# EAGLE design fabenergy.node.v1 (EAGLE 5.11)
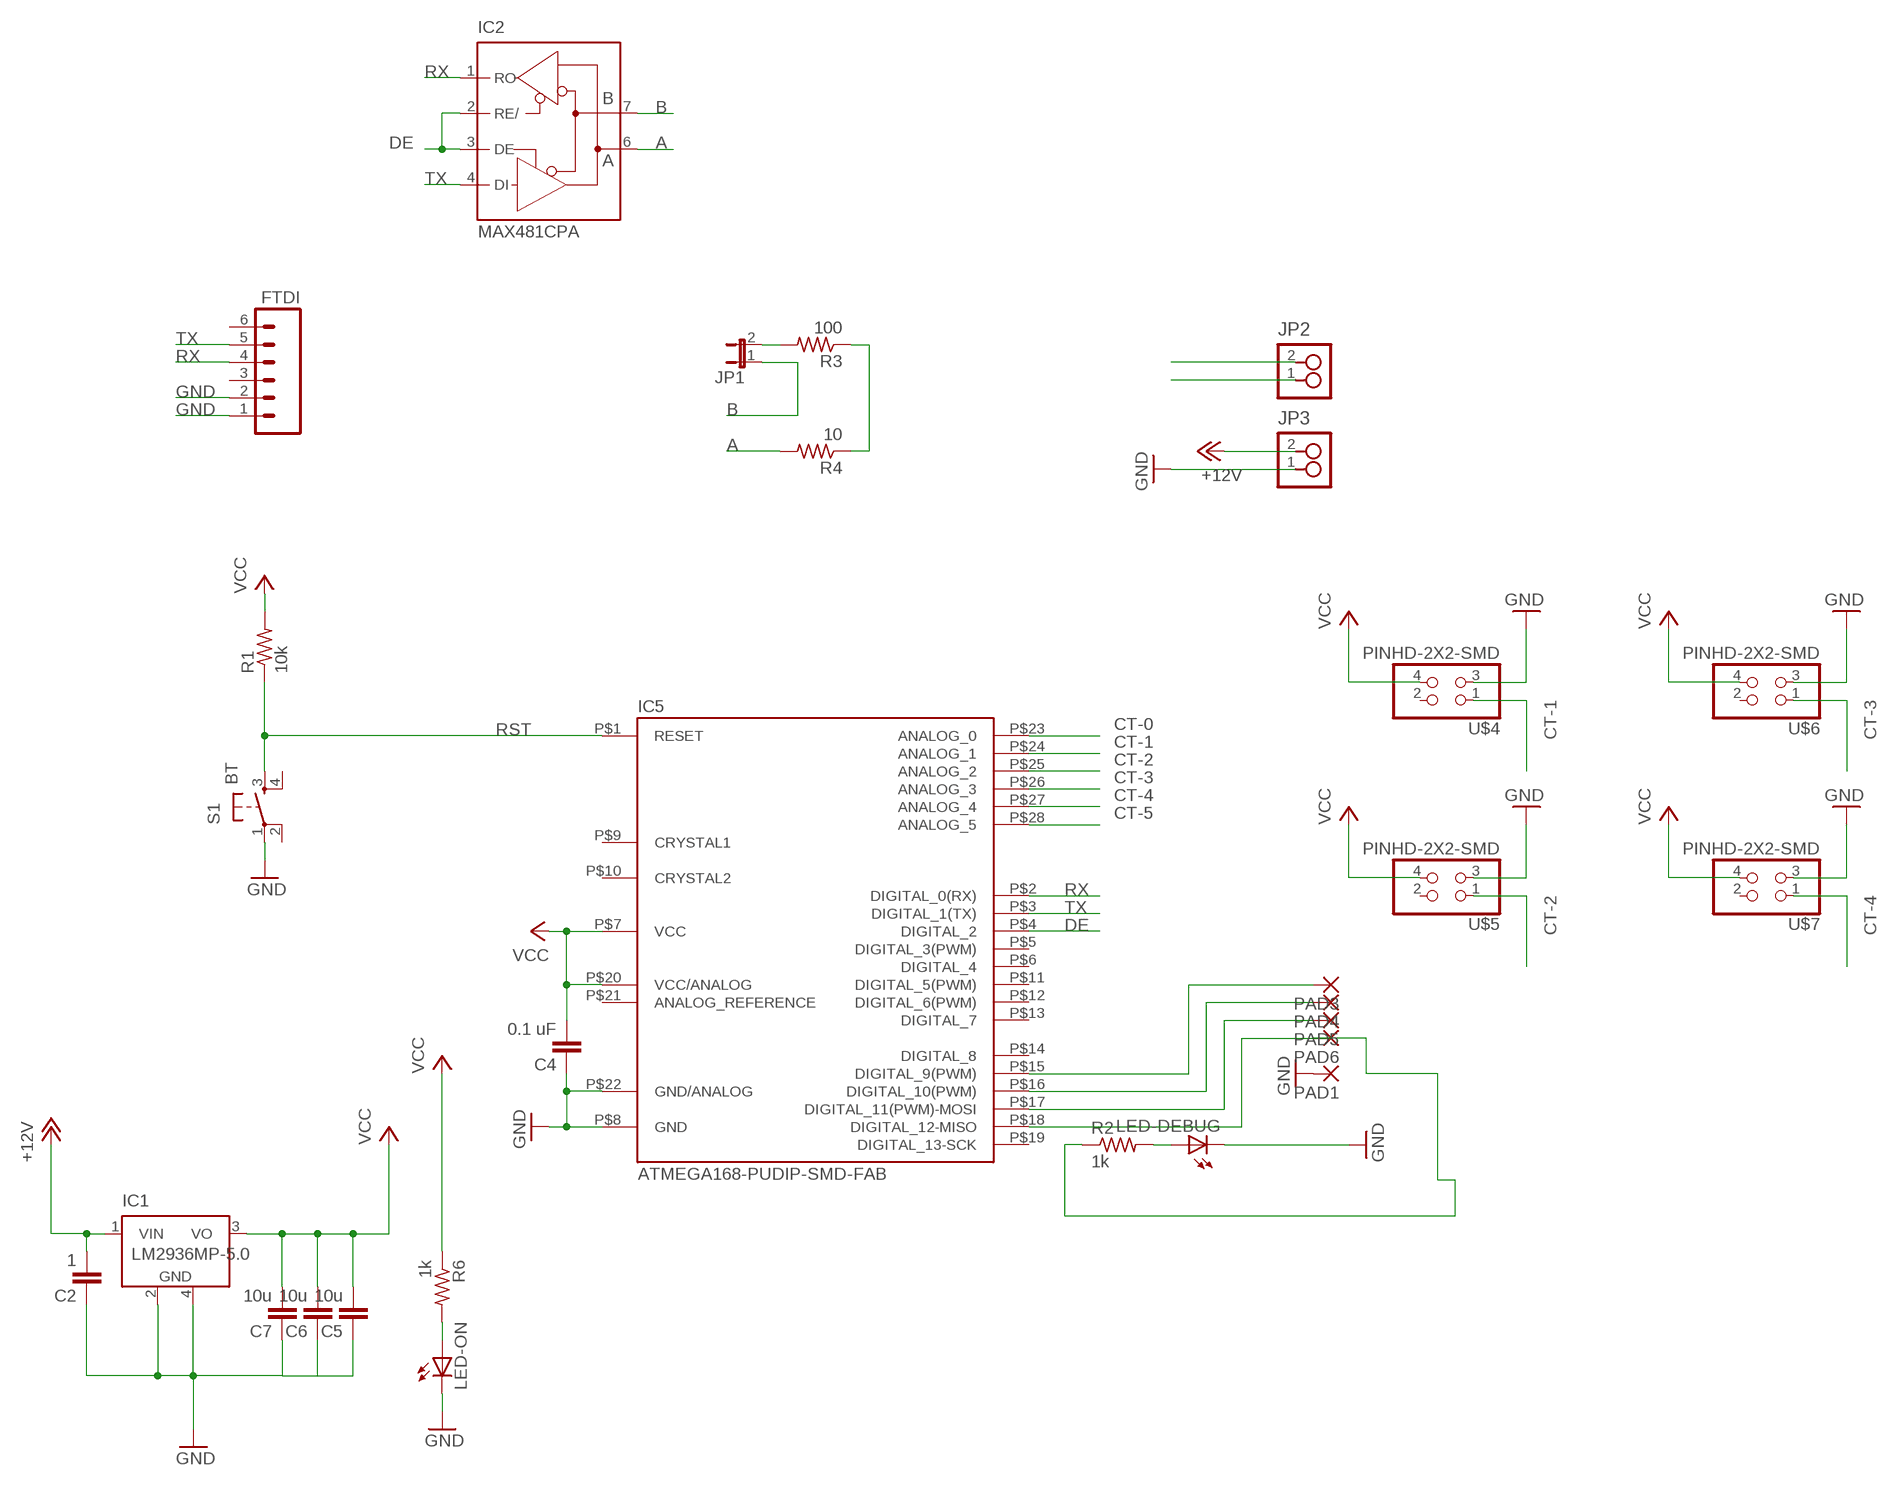
[diagram p0: schematic, sheet 1]

## Parts
C2  1  C-EUC1206  [C1206]
C4  0.1 uF  C-EUC1206  [C1206]
C5  10u  C-EUC1206  [C1206]
C6  10u  C-EUC1206  [C1206]
C7  10u  C-EUC1206  [C1206]
FTDI  M06SMD  [1X06-SMD]
IC1  LM2936MP-5.0  [SOT223]
IC2  MAX481CPA  [DIL08]
IC5  ATMEGA168-PUDIP-SMD-FAB  [DIL28-3-FAB-SMD]
JP1  JUMPER-2PTH  [1X02]
JP2  2_PIN_HEADERSCREW  [SCREW_2]
JP3  2_PIN_HEADERSCREW  [SCREW_2]
LED-DEBUG  LED1206  [1206]
LED-ON  LED1206  [1206]
PAD1  SMD2  [SMD1,27-2,54]
PAD3  SMD2  [SMD1,27-2,54]
PAD4  SMD2  [SMD1,27-2,54]
PAD5  SMD2  [SMD1,27-2,54]
PAD6  SMD2  [SMD1,27-2,54]
R1  10k  RESISTOR1206  [1206]
R2  1k  RESISTOR1206  [1206]
R3  100  RESISTOR1206  [1206]
R4  10  RESISTOR1206  [1206]
R6  1k  RESISTOR1206  [1206]
S1  BT  6MM_SWITCH6MM_SWITCH  [6MM_SWITCH]
U$4  PINHD-2X2-SMD  [2X02SMD]
U$5  PINHD-2X2-SMD  [2X02SMD]
U$6  PINHD-2X2-SMD  [2X02SMD]
U$7  PINHD-2X2-SMD  [2X02SMD]

## Nets
+12V: C2.2 IC1.1(VIN) JP3.2
A: IC2.6(A) JP2.2 R4.2
B: IC2.7(B) JP1.1 JP2.1
CT-0: IC5.P$23(ANALOG_0)
CT-1: IC5.P$24(ANALOG_1) U$4.1
CT-2: IC5.P$25(ANALOG_2) U$5.1
CT-3: IC5.P$26(ANALOG_3) U$6.1
CT-4: IC5.P$27(ANALOG_4) U$7.1
CT-5: IC5.P$28(ANALOG_5)
DE: IC2.2(RE/) IC2.3(DE) IC5.P$4(DIGITAL_2)
GND: C2.1 C4.1 C5.1 C6.1 C7.1 FTDI.1 FTDI.2 IC1.2(GND) IC1.4(GND) IC5.P$8(GND) IC5.P$22(GND/ANALOG) JP3.1 LED-DEBUG.2(C) LED-ON.2(C) PAD1.1(P) S1.1(P) U$4.3 U$5.3 U$6.3 U$7.3
N$1: LED-ON.1(A) R6.2
N$2: LED-DEBUG.1(A) R2.2
N$3: R3.1 R4.1
N$4: IC5.P$15(DIGITAL_9(PWM)) PAD3.1(P)
N$6: IC5.P$17(DIGITAL_11(PWM)-MOSI) PAD5.1(P)
N$7: IC5.P$16(DIGITAL_10(PWM)) PAD4.1(P)
N$8: JP1.2 R3.2
N$11: IC5.P$18(DIGITAL_12-MISO) PAD6.1(P) R2.1
RST: IC5.P$1(RESET) R1.1 S1.3(S)
RX: FTDI.4 IC2.1(RO) IC5.P$2(DIGITAL_0(RX))
TX: FTDI.5 IC2.4(DI) IC5.P$3(DIGITAL_1(TX))
VCC: C4.2 C5.2 C6.2 C7.2 IC1.3(VO) IC5.P$7(VCC) IC5.P$20(VCC/ANALOG) R1.2 R6.1 U$4.4 U$5.4 U$6.4 U$7.4
Unconnected: FTDI.3 FTDI.6 IC5.P$5(DIGITAL_3(PWM)) IC5.P$6(DIGITAL_4) IC5.P$9(CRYSTAL1) IC5.P$10(CRYSTAL2) IC5.P$11(DIGITAL_5(PWM)) IC5.P$12(DIGITAL_6(PWM)) IC5.P$13(DIGITAL_7) IC5.P$14(DIGITAL_8) IC5.P$19(DIGITAL_13-SCK) IC5.P$21(ANALOG_REFERENCE) S1.2(P1) S1.4(S1) U$4.2 U$5.2 U$6.2 U$7.2

## Power pins joined to a net without a drawn wire
GND: IC2.5(GND)
VCC: IC2.8(VCC)

## Library data of the parts
C2 C4-C7 = rcl:C-EU: CAPACITOR, European symbol
FTDI = SparkFun:M06: Header 6 Standard 6-pin 0.1" header. Use with straight break away headers (SKU : PRT-00116), right angle break away headers (PRT-00553), swiss pins (PRT-00743), machine pins (PRT-00117), and female headers (PRT-00115). Molex polarized connector foot print use with SKU : PRT-08094 with associated crimp pins and housings. NOTES ON THE VARIANTS LOCK and LOCK_LONGPADS... This footprint was designed to help hold the alignment of a through-hole component (i.e. 6-pin header) while soldering it into place. You may notice that each hole has been shifted either up or down by 0.005 of an inch from it's more standard position (which is a perfectly straight line). This slight alteration caused the pins (the squares in the middle) to touch the edges of the holes. Because they are alternating, it causes a "brace" to hold the component in place. 0.005 has proven to be the perfect amount of "off-center" position when using our standard breakaway headers. Although looks a little odd when you look at the bare footprint, once you have a header in there, the alteration is very hard to notice. Also, if you push a header all the way into place, it is covered up entirely on the bottom side. This idea of altering the position of holes to aid alignment will be further integrated into the Sparkfun Library for other footprints. It can help hold any component with 3 or more connection pins.
IC1 = national-semiconductor:LM2936MP?*: Ultra-Low Quiescent Current LDO Voltage Regulator Source: Data sheet <http://www.national.com/ds/LM/LM2936.pdf>; MF: NATIONAL SEMICONDUCTOR; MPN: LM2936MP-5.0/NOPB; OC_FARNELL: 1469063; OC_NEWARK: 41K4524
IC2 = maxim:MAX481CPA: RS485 TRANSEIVER
IC5 = Arduino-AVR:ATMEGA168-PU
JP1 = SparkFun:JUMPER-2: Jumper Basic 0.1" spaced jumper. Use with breakaway headers.
JP2 JP3 = ng:2_PIN_HEADER: 2 SMT pin pads
LED-DEBUG LED-ON = ng:LED
PAD1 PAD3-PAD6 = wirepad:SMD2: SMD PAD
R1-R4 R6 = ng:RESISTOR
S1 = ng:6MM_SWITCH: OMRON SWITCH
U$4-U$7 = fab:PINHD-2X2-SMD

## Net classes
0 default: width 0.203 mm
1 power: width 0.254 mm

## Board
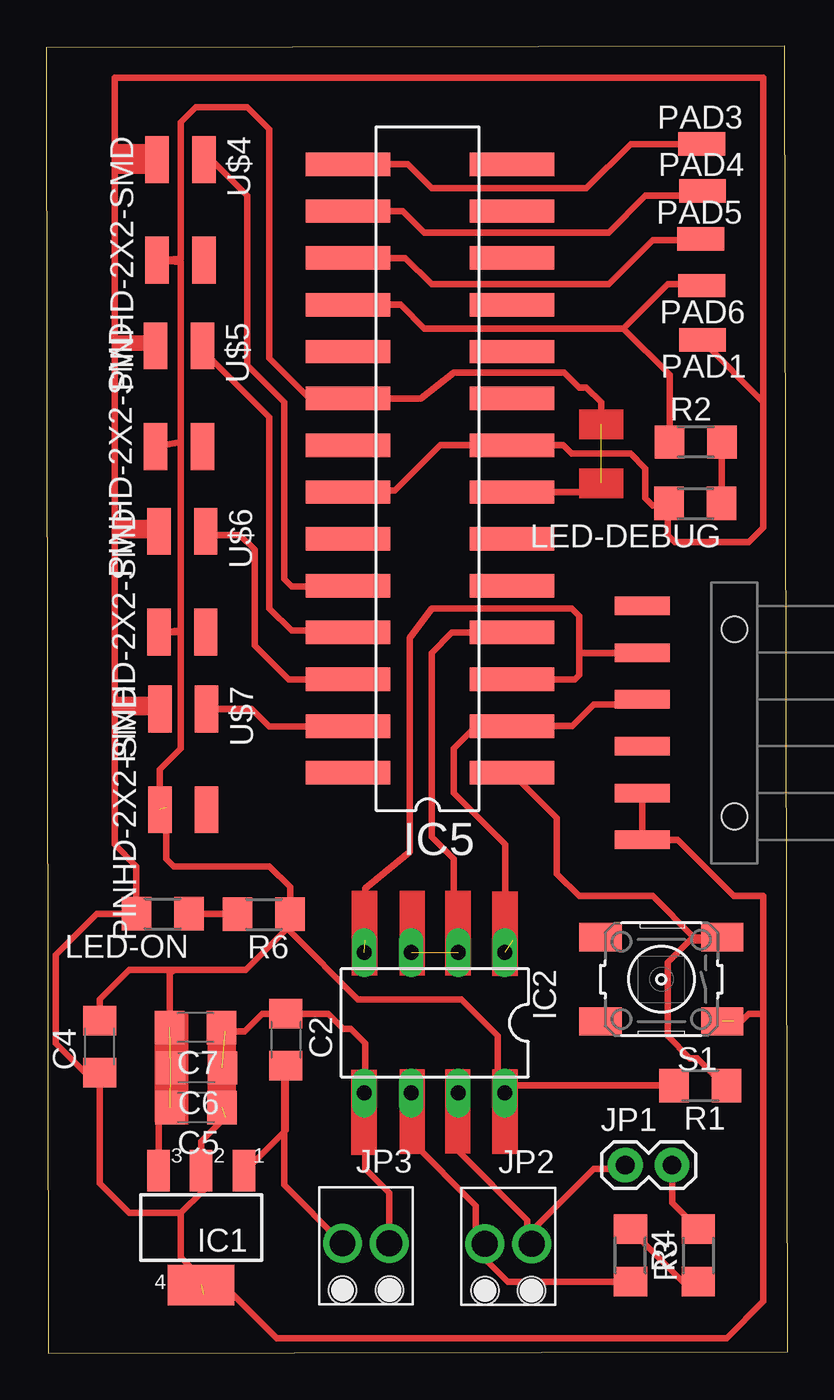
[diagram p1: board, top side]

Size 40.23 x 70.94 mm. Coordinates in mm from the lower left corner, seen from the top.
Outline: 0.13,0 40.23,0.1 40.08,70.94 0,70.84 0.13,0
Copper layers (1*16): Top 0.035mm / dielectric 1.5mm / Bottom 0.035mm
Design rules "fab-tets *": minimum track width 0.35mm, minimum drill 24mil, track to track 14mil, track to pad 14mil, pad to pad 14mil, via to via 14mil, smd to smd 14mil, copper to edge 8mil, drill to drill 8mil, minimum pad ring 10mil, minimum via ring 8mil, stop-mask expansion 4mil, vias tented up to drill 0mil, thermal gap 10mil

### Footprints (pad centres in the part's own frame; a part is rotated, then mirrored left to right if it is on the bottom)
C1206 = smd 1.6 x 1.8: 1 -1.4,0; 2 1.4,0
1X06-SMD = smd 1 x 3: 1 -6.35,5; 2 -3.81,5; 3 -1.27,5; 4 1.27,5; 5 3.81,5; 6 6.35,5 | hole 1.4: -5.08,0; 5.08,0
SOT223 = smd 1.219 x 2.235: 1 -2.311,-3.099; 2 0,-3.099; 3 2.311,-3.099 | smd 3.6 x 2.2: 4 0,3.099
DIL08 = drill 0.813 long: 1 -3.81,-3.81; 2 -1.27,-3.81; 3 1.27,-3.81; 4 3.81,-3.81; 5 3.81,3.81; 6 1.27,3.81; 7 -1.27,3.81; 8 -3.81,3.81
DIL28-3-FAB-SMD = smd 1.27 x 4.572: P$1 -16.51,-4.572; P$2 -13.97,-4.572; P$3 -11.43,-4.572; P$4 -8.89,-4.572; P$5 -6.35,-4.572; P$6 -3.81,-4.572; P$7 -1.27,-4.572; P$8 1.27,-4.572; P$9 3.81,-4.572; P$10 6.35,-4.572; P$11 8.89,-4.572; P$12 11.43,-4.572; P$13 13.97,-4.572; P$14 16.51,-4.572; P$15 16.51,4.318; P$16 13.97,4.318; P$17 11.43,4.318; P$18 8.89,4.318; P$19 6.35,4.318; P$20 3.81,4.318; P$21 1.27,4.318; P$22 -1.27,4.318; P$23 -3.81,4.318; P$24 -6.35,4.318; P$25 -8.89,4.318; P$26 -11.43,4.318; P$27 -13.97,4.318; P$28 -16.51,4.318
1X02 = drill 1.016 pad 1.88 round: 1 0,0; 2 2.54,0
SCREW_2 = drill 1.4 pad 2.108 round: 1 -1.27,-1.27; 2 1.27,-1.27 | hole 1.5: 1.27,1.27; -1.27,1.27
1206 = smd 1.6 x 1.803: 1 -1.422,0; 2 1.422,0
SMD1,27-2,54 = smd 1.27 x 2.54: 1 0,0
6MM_SWITCH = smd 2.286 x 1.524: 1 -3.302,2.286; 2 3.302,2.286; 3 -3.302,-2.286; 4 3.302,-2.286
2X02SMD = smd 2.54 x 1.27: 1 -2.54,1.27; 2 2.92,1.27; 3 -2.54,-1.27; 4 2.92,-1.27

### Placement (x,y rotation side)
C2  13,17.03 270 top
C4  2.91,16.65 90 top
C5  8.13,13.34 180 top
C6  8.16,15.5 180 top
C7  8.11,17.68 180 top
FTDI  37.34,34.22 90 top
IC1  8.41,6.82 180 top
IC2  21.08,17.94 180 top
IC5  20.7,48.01 90 top
JP1  31.42,10.22 0 top
JP2  25.07,4.68 180 top
JP3  17.35,4.71 180 top
LED-DEBUG  35.22,46.13 180 top
LED-ON  6.32,23.86 180 top
PAD1  35.61,55 90 top
PAD3  35.56,65.64 270 top
PAD4  35.61,63.08 270 top
PAD5  35.51,60.48 270 top
PAD6  35.56,57.95 90 top
R1  35.48,14.54 180 top
R2  35.25,49.46 0 top
R3  35.38,5.32 90 top
R4  31.7,5.32 270 top
R6  11.81,23.83 180 top
S1  33.38,20.3 180 top
U$4  7.29,62.24 270 top
U$5  7.21,52.13 270 top
U$6  7.39,42.07 270 top
U$7  7.44,32.43 270 top

### Tracks (layer width: path | path; a pad name or v marks a point on that pad's centre or on a via)
+12V
  Top 0.35: IC1.1 10.81,9.92 12.91,12.02 | 12.91,12.02 12.91,15.54 C2.2 13,12.11 12.91,12.02 | 12.91,12.02 12.91,9.14 JP3.2
A
  Top 0.35: IC2.6 19.81,11.52 23.31,8.02 23.31,6.44 JP2.2 23.71,5.87 23.71,5.22 25.04,3.89 R4.2
B
  Top 0.35: IC2.7 22.35,10.98 26.11,7.22 26.11,6.18 JP2.1 26.34,6.65 29.71,10.02 31.22,10.02 JP1.1
CT-1
  Top 0.35: U$4.1 8.95,64.78 10.91,62.82 10.91,53.62 12.91,51.62 12.91,42.02 13.31,41.62 16.34,41.62 IC5.P$24
CT-2
  Top 0.35: U$5.1 8.88,54.05 12.11,50.82 12.11,40.42 13.31,39.22 16.29,39.22 IC5.P$25
CT-3
  Top 0.35: IC5.P$26 13.15,36.58 11.31,38.42 11.31,43.62 10.51,44.42 8.85,44.42 U$6.1
CT-4
  Top 0.35: U$7.1 11.17,34.97 12.11,34.02 14.91,34.02 15.31,34.02 16.36,34.02 IC5.P$27
DE  (1 unrouted)
  Top 0.35: IC5.P$4 22.02,39.12 20.91,38.02 20.91,28.02 22.11,26.82 22.11,21.99 IC2.2
DE1
  Top 0.35: 22.35,10.98 21.92,11.41 22.05,11.41 22.07,11.44
GND  (4 unrouted)
  Top 0.35: FTDI.2 FTDI.1 34.26,27.87 37.31,24.82 38.91,24.82 38.91,18.42 | 38.91,18.42 38.11,18.42 37.31,17.62 37.31,18.02 | 7.31,7.62 4.51,7.62 2.91,9.23 C4.1 2.88,15.22 2.11,15.22 0.51,16.82 0.51,21.62 2.75,23.86 LED-ON.2 4.9,26.43 3.71,27.62 3.71,35.22 | 7.31,7.62 8.51,8.82 8.51,9.82 IC1.2 8.41,11.52 9.71,12.82 9.71,17.48 | 9.71,17.48 C7.1 | 9.71,17.48 10.77,17.48 11.71,18.42 C2.1 15.31,18.43 16.11,17.62 16.51,17.62 17.31,16.82 17.31,14.17 IC2.5 17.31,14.09 17.31,10.02 18.62,8.72 JP3.1 | 3.71,35.22 4.51,34.82 6.02,34.82 U$7.3 4.77,34.97 3.71,35.22 | U$4.3 6.02,64.73 3.71,64.42 | U$5.3 5.8,54.82 3.71,54.82 | 3.71,35.22 3.71,44.82 | 3.71,44.82 4.11,44.42 5.93,44.42 U$6.3 4.32,44.61 3.71,44.82 | IC5.P$22 16.46,46.82 18.91,46.82 21.38,49.28 IC5.P$8 28.05,49.28 28.51,48.82 31.71,48.82 32.51,48.02 32.51,46.42 32.91,46.02 33.69,46.02 LED-DEBUG.2 33.71,46.04 33.71,44.42 34.11,44.02 38.11,44.02 38.91,44.82 38.91,51.62 | 7.31,7.62 7.31,5.22 8.91,3.62 8.51,3.22 10.11,3.22 12.51,0.82 36.91,0.82 38.91,2.82 38.91,18.42 | PAD1.1 35.61,54.92 38.91,51.62 | 3.71,44.82 3.71,54.82 | 3.71,54.82 3.71,64.42 | 3.71,64.42 3.71,69.22 38.91,69.22 38.91,51.62
N$1
  Top 0.35: LED-ON.1 10.36,23.86 R6.2
N$2
  Top 0.35: LED-DEBUG.1 36.65,49.44 R2.2
N$3
  Top 0.35: R3.1 34.54,3.89 R4.1
N$4
  Top 0.35: IC5.P$15 19.61,64.52 20.91,63.22 29.31,63.22 31.71,65.62 35.54,65.62 PAD3.1
N$6
  Top 0.35: IC5.P$17 19.49,59.44 20.91,58.02 30.51,58.02 32.91,60.42 35.71,60.42 36.11,60.82 35.84,60.82 PAD5.1
N$7
  Top 0.35: IC5.P$16 19.35,61.98 20.51,60.82 30.51,60.82 32.51,62.82 35.87,62.82 | 36.51,62.82 35.87,62.82 | 35.87,62.82 PAD4.1
N$8
  Top 0.35: JP1.2 33.96,8.16 R3.2
N$11
  Top 0.35: IC5.P$18 19.23,56.9 20.51,55.62 31.31,55.62 | 31.31,55.62 33.71,58.02 35.48,58.02 PAD6.1 | R2.1 33.83,53.11 31.31,55.62
RST
  Top 0.35: R1.1 36.8,14.54 35.31,16.02 34.91,16.02 33.71,17.22 33.71,21.22 34.91,22.42 36.85,22.42 | 36.85,22.42 37.31,22.42 | 36.85,22.42 S1.3 35.15,22.59 32.91,24.82 28.91,24.82 27.71,26.02 27.71,29.06 IC5.P$1
RX  (1 unrouted)
  Top 0.35: 25.31,22.42 24.91,22.82 24.91,27.62 22.11,30.42 22.11,32.82 23.34,34.04 IC5.P$2 28.54,34.04 29.71,35.22 32.07,35.22 FTDI.4
TX  (1 unrouted)
  Top 0.35: 28.91,38.02 28.91,40.02 28.51,40.42 20.91,40.42 19.71,38.82 19.71,27.22 17.31,25.22 17.31,22.42 | IC5.P$3 28.68,36.58 28.91,36.82 28.91,38.02 | 28.91,38.02 32.35,38.02 | 32.35,38.02 32.91,38.02 | 32.35,38.02 FTDI.5
VCC  (4 unrouted)
  Top 0.35: R1.2 25.3,14.54 IC2.8 24.51,14.51 24.51,17.22 22.51,19.22 16.91,19.22 13.23,22.9 13.23,23.22 | IC1.3 6.1,12.71 C5.2 | 13.23,23.22 R6.1 13.23,25.3 12.11,26.42 6.91,26.42 6.51,26.82 6.51,29.62 6.11,30.02 | C4.2 2.91,19.21 4.51,20.82 6.91,20.82 | 6.91,20.82 10.83,20.82 13.23,23.22 | C7.2 6.71,20.61 6.91,20.82 | U$7.4 6.17,31.68 7.31,32.82 7.31,39.16 U$6.4 6.18,39.15 7.31,39.22 7.31,49.44 | 7.31,49.44 U$5.4 | 7.31,49.44 7.31,59.23 U$4.4 7.31,59.42 7.31,66.82 8.11,67.62 10.91,67.62 12.11,66.42 12.11,54.02 14.31,51.82 IC5.P$20 20.32,51.82 22.11,53.22 28.11,53.22 28.91,52.42 29.31,52.42 30.11,51.62 30.11,50.42 | IC5.P$7 29.64,46.74 30.11,47.22
(copper drawn outside any net)
  shapes: Top area x26